# Altium project PowerBoard.PrjPcb
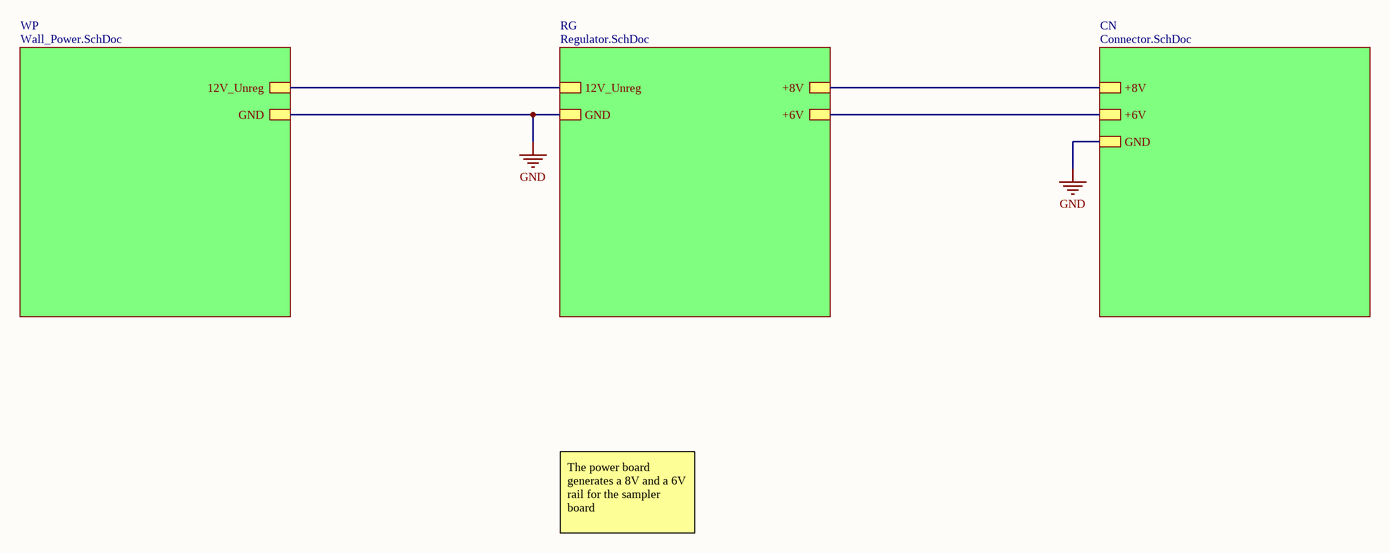
[diagram p0: Top.SchDoc]
4 sheets, 14 parts. Net scope: strictly hierarchical (ports join the sheet entries above them; power ports are local).
Board file: PCB.PcbDoc
Sheets:
  Top.SchDoc
    CN = Connector.SchDoc
    RG = Regulator.SchDoc
    WP = Wall_Power.SchDoc

## Sheet Top.SchDoc
size B

### Sub-sheets
CN = Connector.SchDoc: GND, +8V, +6V
RG = Regulator.SchDoc: 12V_Unreg, GND, +8V, +6V
WP = Wall_Power.SchDoc: GND, 12V_Unreg

### Nets
+6V: sheet CN/+6V, sheet RG/+6V
+8V: sheet CN/+8V, sheet RG/+8V
+12V_Unreg: sheet RG/12V_Unreg, sheet WP/12V_Unreg
GND: sheet CN/GND, sheet RG/GND, sheet WP/GND

### Notes on the sheet
- The power board generates a 8V and a 6V rail for the sampler board

## Sheet Connector.SchDoc
size B
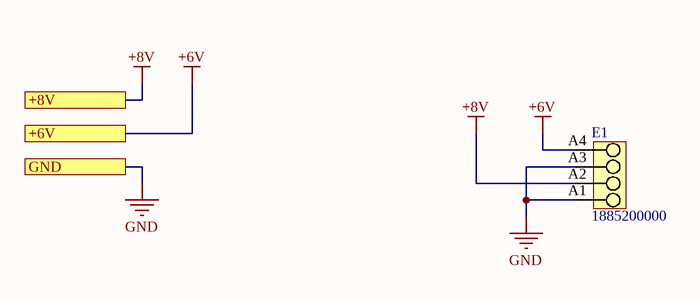
[diagram p1: Connector.SchDoc]

### Parts
E1  1885200000  [LSF_SMT_3_5_135_04]

### Ports
+6V, +8V, GND

### Nets
+6V: E1.A4 ; port +6V
+8V: E1.A2 ; port +8V
GND: E1.A1 E1.A3 ; port GND

### Library data of the parts
E1 = CMP-1559-02099-1: OMNIMATE Signal - series LSF; Manufacturer: Weidmueller; Pitch_inch: 0,138 inch; Contact_material: Cu-Leg; Mounting_onto_the_PCB: Reflow solder connection; Rated_voltage_use_group_B_UL_1059: 300 V; Side_termination_characteristic: closed side; Wire_cross_section_AWG_min_UL_1059: AWG 24; Solid_min_H05_07_V_U: 0,2 mm²; No_of_poles: 4; Pitch_mm: 3,5 mm; Solder_pin_length_mm: 1,5 mm; Wire_cross_section_AWG_max_UL_1059: AWG 16; Contact_surface: tinned; Solid_max_H05_07_V_U: 1,5 mm²; Short_text_for_material: LSF-SMT 3.50/04/135 1.5SN BK TU; Rated_current_min_no_of_poles_TU_20_deg_C: 19 A; Rated_current_use_group_B_UL_1059: 12 A; Rated_voltage_for_surge_voltage_class_pollution_degree_II_2: 320 V; Insulating_material: LCP GF; UL_94_flammability_rating: V-0; ComponentLink1URL: http://www.weidmueller.com/; ComponentLink1Description: Manufacturer URL; ComponentLink2URL: http://catalog.weidmueller.com/catalog/Start.do?localeId=en&ObjectID=1885200000; PackageReference: LSF_SMT_3_5_135_04; Qty: 37 PCS; Revision: V1; ComponentLink2Description: URL Link1; PartNumber: 1885200000; Packaging: Tube; Colour: Black

## Sheet Regulator.SchDoc
size B
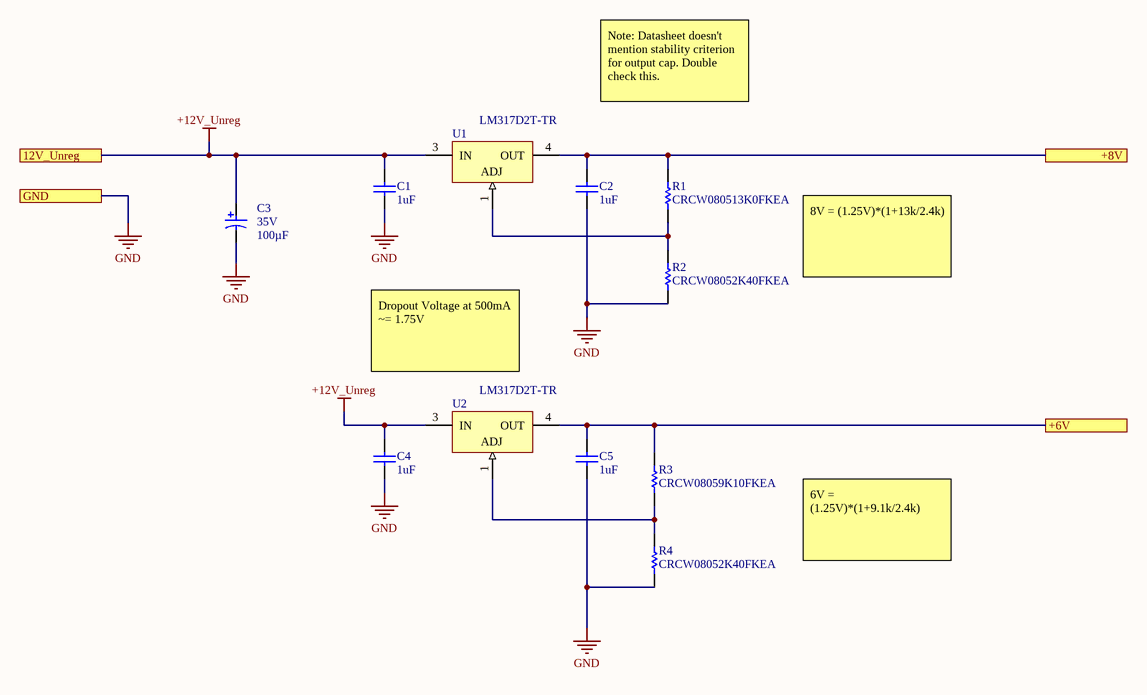
[diagram p2: Regulator.SchDoc]

### Parts
C1  1uF  [CAPC2013X100X50NL20T25]
C2  1uF  [CAPC2013X100X50NL20T25]
C3  Capacitance: 100µF  Voltage Rating: 35V  [PNSC-FC-V-G_V]  (hidden comment: EEEFC1V101P)
C4  1uF  [CAPC2013X100X50NL20T25]
C5  1uF  [CAPC2013X100X50NL20T25]
R1  CRCW080513K0FKEA  [RESC2013X50X30LL20T20]
R2  CRCW08052K40FKEA  [RESC2013X50X30NL20T20]
R3  CRCW08059K10FKEA  [RESC2013X50X30ML20T20]
R4  CRCW08052K40FKEA  [RESC2013X50X30NL20T20]
U1  LM317D2T-TR  [TO-263_N]
U2  LM317D2T-TR  [TO-263_N]

### Ports
12V_Unreg, +6V, +8V, GND

### Nets
+6V: C5.2 R3.2 U2.4(OUT) ; port +6V
+8V: C2.2 R1.2 U1.4(OUT) ; port +8V
+12V_Unreg: C1.2 C3.1 C4.2 U1.3(IN) U2.3(IN) ; port 12V_Unreg
GND: C1.1 C2.1 C3.2 C4.1 C5.1 R2.2 R4.2 ; port GND
NetR1_1: R1.1 R2.1 U1.1(ADJ)
NetR3_1: R3.1 R4.1 U2.1(ADJ)

### Notes on the sheet
- Note: Datasheet doesn't mention stability criterion for output cap. Double check this.
- 8V = (1.25V)*(1+13k/2.4k)
- Dropout Voltage at 500mA ~= 1.75V
- 6V = (1.25V)*(1+9.1k/2.4k)

### Library data of the parts
C1 C2 C4 C5 = CMP-2007-03716-1: Part Number: C0805X105K3RACTU; Manufacturer: Kemet
C3 = CMP-2000-06202-1: Aluminum Electrolytic Capacitor, 100 uF, +/- 20%, 35 V, 2-Pin SMD (Size Code G), -40 to 105 degC, RoHS, Tape and Reel; Manufacturer: Panasonic; Impedance Frequency: 100kHz; Power Factor Frequency: 120Hz; Life Time @ Temperature: 1000hours@105°C; Ripple Current Temperature: 105°C; Capacitor Case Style: RadialCan-SMD; SVHC: ToBeAdvised; Operating Lifetime: 1000h; Lead Cross-section Width: 0.9mm; Power Factor: 0.12; Impedance: 0.4ohm; Product Range: PANASONIC-FCSeries; Ripple Current AC: 220mA; Power Factor Temperature: 20°C; External Width: 10.3mm; External Length / Height: 10.2mm; Tolerance +: 20%; Operating Temperature Min: -40°C; Diameter: 10mm; Height: 10.2mm; Tolerance -: 20%; Package Reference: FC-V-G; Manufacturer URL: http://www.panasonic.com/; Capacitance Tolerance: ±20%; Tape Width: 16mm; Packaging: CutTape; Datasheet URL: http://industrial.panasonic.com/cdbs/www-data/pdf/RDE0000/ABA0000C1172.pdf; Package URL: http://industrial.panasonic.com/cdbs/www-data/pdf/RDE0000/DME0000COL48.pdf; Operating Temperature Range: -40°Cto+105°C; Operating Temperature Max: 105°C; Ripple Current Frequency: 100kHz; Datasheet Version: 03/2016; Package / Case: G; Series: FC; Lifetime @ Temperature: 1000hours@105°C; Mounting Technology: SurfaceMount; AE Capacitor Case: RadialCan-SMD; Impedance Temperature: 20°C; Package Description: 2-Pin Electrolytic Aluminum Capacitor, Body 10.3 x 10.3 mm; Operating life Time: 1000h; Capacitance Tolerance ±: ±20%; Voltage Rating V DC: 35V; MSL: (NotAvailable)
R1 = CMP-2001-04945-1: Manufacturer: Vishay Dale; Part Number: CRCW080513K0FKEA
R2 R4 = CMP-2001-03768-1: Manufacturer: Vishay Dale; Part Number: CRCW08052K40FKEA
R3 = CMP-2001-04176-1: Manufacturer: Vishay Dale; Part Number: CRCW08059K10FKEA
U1 U2 = CMP-0244-00094-1: 1.5A, 1.2V to 37V Adjustable Voltage Regulator, 3-Pin D2PAK, Tape and Reel; DatasheetVersion: 1/11/2011; PackageVersion: 2011; PackageDescription: 3-Pin Transistor Outline Package 2.54 mm Pitch, 15.4 mm Lead Span (D2PAK); ComponentLink2URL: http://www.st.com/internet/com/TECHNICAL_RESOURCES/TECHNICAL_LITERATURE/DATASHEET/CD00000455.pdf; PackageReference: TO-263; ComponentLink1Description: Manufacturer URL; ComponentLink2Description: Datasheet; ComponentLink1URL: http://www.st.com

## Sheet Wall_Power.SchDoc
size B
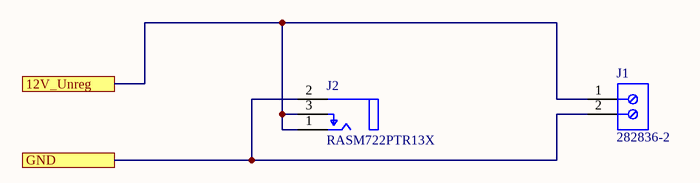
[diagram p3: Wall_Power.SchDoc]

### Parts
J1  282836-2  [TECO-282836-2_V]
J2  RASM722PTR13X  [FP-RASM722PTR13X-MFG]

### Ports
12V_Unreg, GND

### Nets
+12V_Unreg: J1.1 J2.1(TIP_TERMINAL(CENTER_PIN)) J2.3(SHUNT_TERMINAL) ; port 12V_Unreg
GND: J1.2 J2.2(SLEEVE_TERMINAL) ; port GND

### Library data of the parts
J1 = CMP-1684-00017-1: Female Header, Pitch 5 mm, 1 x 2 Position, Height 10 mm, Tail Length 3.5 mm, Rohs, Bulk; Manufacturer: TE Connectivity; Wire Gauge: 16-30AWG; Product Training Modules: Wire-to-BoardEurostyleTerminalBlocks; Clamp Material - Plating: Brass-NickelPlated; Voltage: 300V; Mating Orientation: HorizontalwithBoard; Current: 13.5A; Pitch: 0.197"(5.00mm); Screw Thread: M3; 3D Model: 282836-2.pdf; Other Names: 5ULV-02B / A98076; Dynamic Catalog: BuchananSeries; Number of Levels: 1; Torque - Screw: 0.68Nm(6Lb-In); Featured Product: EurostyleTerminalBlockConnectors; Positions Per Level: 2; Wire Termination: Screw-RisingCageClamp; Datasheet URL: http://www.te.com.cn/commerce/DocumentDelivery/DDEController?Action=showdoc&DocId=Catalog+Section%7F1308389_EUROSTYLE_TERMINAL_BLOCKS%7F0607%7Fpdf%7FEnglish%7FENG_CS_1308389_EUROSTYLE_TERMINAL_BLOCKS_0607.pdf%7F282836-2; Color: Green; Family: TerminalBlocks-WiretoBoard; RoHS Information: 282836-2StatementofCompliance; Standard Package: 300; Contact Material - Plating: Brass-TinPlated; Manufacturer URL: http://www.te.com; Housing Material: Polyamide(PA66),Nylon6/6; Features: Interlocking(Side); Package Description: Female Header, Pitch 5 mm, 1 x 2 Position, Height 10 mm, Tail Length 3.5 mm; Mounting Type: ThroughHole; Package Reference: THD; Packaging: Bulk; Series: Buchanan; Category: Connectors,Interconnects; Screw Material - Plating: Brass-NickelPlated
J2 = CMP-47995-000002-1: CONN PWR JACK 2.1X5.5MM SOLDER; Shielding: Unshielded; Gender: Male; Current Rating: 5A; Termination: Solder; Contact Material: Copper Alloy; Package Quantity: 120; Case/Package: SMD/SMT; Contact Plating: Tin; Connector Type: Jack; Housing Material: Thermoplastic; Mount: Surface Mount; Housing Color: Black; Color: Black

## Nets that join several sheets
+6V: Connector (E1.A4), Regulator (C5.2 R3.2 U2.4)
+8V: Connector (E1.A2), Regulator (C2.2 R1.2 U1.4)
+12V_Unreg: Regulator (5 pins), Wall_Power (J1.1 J2.1 J2.3)
GND: Connector (E1.A1 E1.A3), Regulator (7 pins), Wall_Power (J1.2 J2.2)